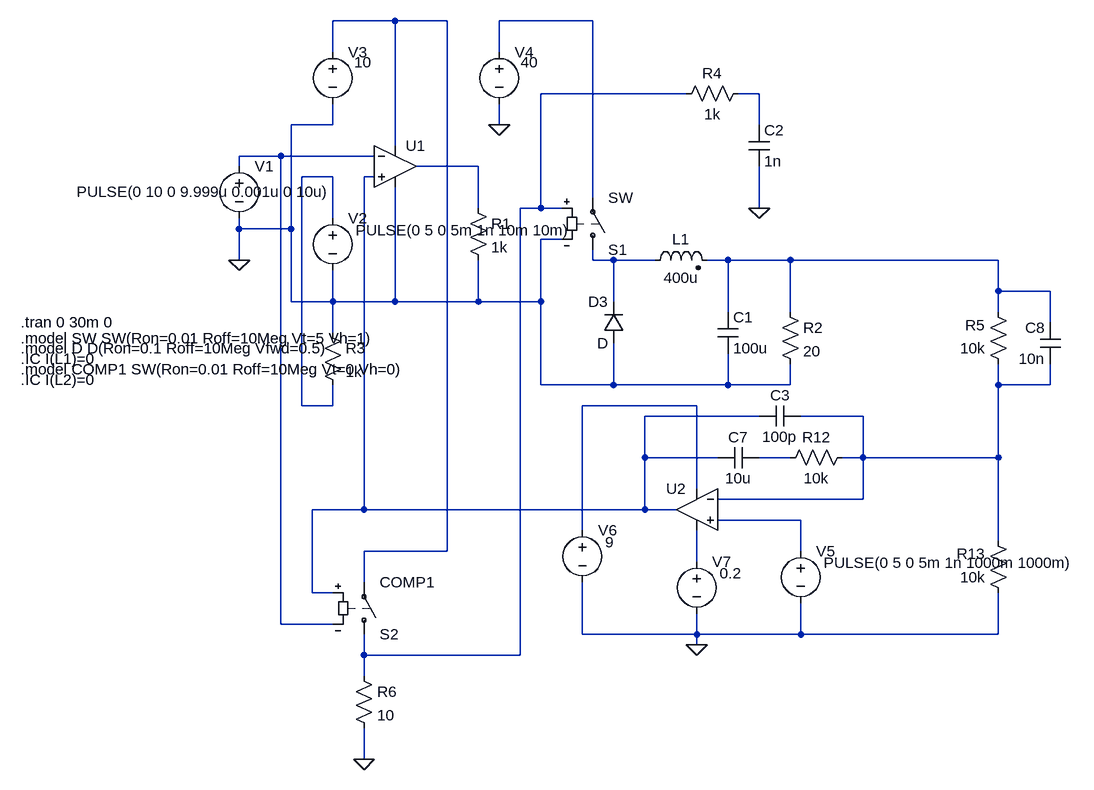
[diagram p0: schematic Variable_Buck.asc]
Variable_Buck.asc, the LTspice schematic file:
Version 4
SHEET 1 1636 2300
WIRE 368 -112 272 -112
WIRE 448 -112 368 -112
WIRE 672 -112 528 -112
WIRE 272 -64 272 -112
WIRE 528 -64 528 -112
WIRE 816 0 592 0
WIRE 928 0 896 0
WIRE 272 48 272 16
WIRE 272 48 208 48
WIRE 528 48 528 16
WIRE 928 48 928 0
WIRE 368 80 368 -112
WIRE 192 96 128 96
WIRE 336 96 192 96
WIRE 128 112 128 96
WIRE 496 112 400 112
WIRE 272 128 224 128
WIRE 336 128 320 128
WIRE 672 160 672 -112
WIRE 496 176 496 112
WIRE 592 176 592 0
WIRE 592 176 560 176
WIRE 624 176 592 176
WIRE 928 176 928 112
WIRE 272 192 272 128
WIRE 128 208 128 192
WIRE 208 208 208 48
WIRE 208 208 128 208
WIRE 624 224 592 224
WIRE 128 256 128 208
WIRE 672 256 672 240
WIRE 704 256 672 256
WIRE 768 256 704 256
WIRE 880 256 848 256
WIRE 976 256 880 256
WIRE 1296 256 976 256
WIRE 1296 304 1296 256
WIRE 1376 304 1296 304
WIRE 208 320 208 208
WIRE 272 320 272 272
WIRE 272 320 208 320
WIRE 368 320 368 144
WIRE 368 320 272 320
WIRE 496 320 496 256
WIRE 496 320 368 320
WIRE 592 320 592 224
WIRE 592 320 496 320
WIRE 704 320 704 256
WIRE 880 336 880 256
WIRE 976 336 976 256
WIRE 1296 336 1296 304
WIRE 1376 352 1376 304
WIRE 272 368 272 320
WIRE 592 448 592 320
WIRE 704 448 704 384
WIRE 704 448 592 448
WIRE 880 448 880 400
WIRE 880 448 704 448
WIRE 976 448 976 416
WIRE 976 448 880 448
WIRE 1296 448 1296 416
WIRE 1376 448 1376 416
WIRE 1376 448 1296 448
WIRE 224 480 224 128
WIRE 272 480 272 448
WIRE 272 480 224 480
WIRE 832 480 656 480
WIRE 928 496 752 496
WIRE 1088 496 992 496
WIRE 752 560 752 496
WIRE 864 560 752 560
WIRE 976 560 928 560
WIRE 1088 560 1088 496
WIRE 1088 560 1056 560
WIRE 1296 560 1296 448
WIRE 1296 560 1088 560
WIRE 832 608 832 480
WIRE 1088 624 1088 560
WIRE 1088 624 864 624
WIRE 320 640 320 128
WIRE 320 640 240 640
WIRE 752 640 752 560
WIRE 752 640 320 640
WIRE 800 640 752 640
WIRE 992 656 864 656
WIRE 656 672 656 480
WIRE 1296 688 1296 560
WIRE 448 704 448 -112
WIRE 448 704 320 704
WIRE 992 704 992 656
WIRE 832 720 832 672
WIRE 320 752 320 704
WIRE 240 768 240 640
WIRE 272 768 240 768
WIRE 192 816 192 96
WIRE 272 816 192 816
WIRE 656 832 656 752
WIRE 832 832 832 800
WIRE 832 832 656 832
WIRE 992 832 992 784
WIRE 992 832 832 832
WIRE 1296 832 1296 768
WIRE 1296 832 992 832
WIRE 832 848 832 832
WIRE 320 864 320 832
WIRE 560 864 560 176
WIRE 560 864 320 864
WIRE 320 896 320 864
WIRE 320 1024 320 976
FLAG 128 256 0
FLAG 528 48 0
FLAG 832 848 0
FLAG 928 176 0
FLAG 320 1024 0
SYMBOL voltage 128 96 R0
WINDOW 3 -250 55 Left 2
WINDOW 123 0 0 Left 0
WINDOW 39 0 0 Left 0
SYMATTR Value PULSE(0 10 0 9.999u 0.001u 0 10u)
SYMATTR InstName V1
SYMBOL OpAmps\\UniversalOpamp2 368 112 R0
SYMATTR InstName U1
SYMBOL voltage 272 176 R0
WINDOW 3 35 34 Left 2
WINDOW 123 0 0 Left 0
WINDOW 39 0 0 Left 0
SYMATTR Value PULSE(0 5 0 5m 1n 10m 10m)
SYMATTR InstName V2
SYMBOL voltage 272 -80 R0
WINDOW 3 33 32 Left 2
WINDOW 123 0 0 Left 0
WINDOW 39 0 0 Left 0
SYMATTR Value 10
SYMATTR InstName V3
SYMBOL res 480 160 R0
SYMATTR InstName R1
SYMATTR Value 1k
SYMBOL sw 672 256 M180
SYMATTR InstName S1
SYMBOL voltage 528 -80 R0
WINDOW 3 33 32 Left 2
WINDOW 123 0 0 Left 0
WINDOW 39 0 0 Left 0
SYMATTR Value 40
SYMATTR InstName V4
SYMBOL ind2 752 272 R270
WINDOW 0 32 56 VTop 2
WINDOW 3 4 56 VBottom 2
SYMATTR InstName L1
SYMATTR Value 400u
SYMBOL cap 864 336 R0
SYMATTR InstName C1
SYMATTR Value 100u
SYMATTR Value2 IC=0
SYMBOL res 960 320 R0
SYMATTR InstName R2
SYMATTR Value 20
SYMBOL OpAmps\\UniversalOpamp2 832 640 M0
SYMATTR InstName U2
SYMBOL res 256 352 R0
SYMATTR InstName R3
SYMATTR Value 1k
SYMBOL voltage 992 688 R0
WINDOW 3 35 34 Left 2
WINDOW 123 0 0 Left 0
WINDOW 39 0 0 Left 0
SYMATTR Value PULSE(0 5 0 5m 1n 1000m 1000m)
SYMATTR InstName V5
SYMBOL res 912 -16 R90
WINDOW 0 0 56 VBottom 2
WINDOW 3 32 56 VTop 2
SYMATTR InstName R4
SYMATTR Value 1k
SYMBOL cap 912 48 R0
SYMATTR InstName C2
SYMATTR Value 1n
SYMATTR Value2 IC=0
SYMBOL res 1312 432 R180
WINDOW 0 36 76 Left 2
WINDOW 3 36 40 Left 2
SYMATTR InstName R5
SYMATTR Value 10k
SYMBOL voltage 656 656 R0
WINDOW 3 35 34 Left 2
WINDOW 123 0 0 Left 0
WINDOW 39 0 0 Left 0
SYMATTR Value 9
SYMATTR InstName V6
SYMBOL voltage 832 704 R0
WINDOW 3 35 34 Left 2
WINDOW 123 0 0 Left 0
WINDOW 39 0 0 Left 0
SYMATTR Value 0.2
SYMATTR InstName V7
SYMBOL sw 320 848 M180
SYMATTR InstName S2
SYMATTR Value COMP1
SYMBOL res 304 880 R0
SYMATTR InstName R6
SYMATTR Value 10
SYMBOL cap 992 480 R90
WINDOW 0 0 32 VBottom 2
WINDOW 3 32 32 VTop 2
SYMATTR InstName C3
SYMATTR Value 100p
SYMATTR Value2 IC=0
SYMBOL res 960 576 R270
WINDOW 0 32 56 VTop 2
WINDOW 3 0 56 VBottom 2
SYMATTR InstName R12
SYMATTR Value 10k
SYMBOL cap 928 544 R90
WINDOW 0 0 32 VBottom 2
WINDOW 3 32 32 VTop 2
SYMATTR InstName C7
SYMATTR Value 10u
SYMATTR Value2 IC=0
SYMBOL cap 1392 416 R180
WINDOW 0 24 56 Left 2
WINDOW 3 24 8 Left 2
SYMATTR InstName C8
SYMATTR Value 10n
SYMATTR Value2 IC=0
SYMBOL diode 720 384 R180
WINDOW 0 24 64 Left 2
WINDOW 3 24 0 Left 2
SYMATTR InstName D3
SYMBOL res 1312 784 R180
WINDOW 0 36 76 Left 2
WINDOW 3 36 40 Left 2
SYMATTR InstName R13
SYMATTR Value 10k
TEXT -208 352 Left 2 !.tran 0 30m 0
TEXT -208 376 Left 2 !.model SW SW(Ron=0.01 Roff=10Meg Vt=5 Vh=1)
TEXT -208 392 Left 2 !.model D D(Ron=0.1 Roff=10Meg Vfwd=0.5)
TEXT -208 408 Left 2 !.IC I(L1)=0
TEXT -208 424 Left 2 !.model COMP1 SW(Ron=0.01 Roff=10Meg Vt=0 Vh=0)
TEXT -208 440 Left 2 !.IC I(L2)=0

The netlist it stands for:
* Variable_Buck.asc
V1 N005 0 PULSE(0 10 0 9.999u 0.001u 0 10u)
XU1 N008 N005 N001 0 N006 level.2 Avol=1Meg GBW=10Meg Slew=10Meg ilimit=25m rail=0 Vos=0 phimargin=45 en=0 enk=0 in=0 ink=0 Rin=500Meg  ; pins IN+ IN- V+ V- OUT
V2 N007 0 PULSE(0 5 0 5m 1n 10m 10m)
V3 N001 0 10
R1 N006 0 1k
S1 N009 N002 N003 0 SW
V4 N002 0 40
L1 N009 N010 400u
C1 N010 0 100u IC=0
R2 N010 0 20
XU2 N014 N011 N012 N015 N008 level.2 Avol=1Meg GBW=10Meg Slew=10Meg ilimit=25m rail=0 Vos=0 phimargin=45 en=0 enk=0 in=0 ink=0 Rin=500Meg  ; pins IN+ IN- V+ V- OUT
R3 0 N007 1k
V5 N014 0 PULSE(0 5 0 5m 1n 1000m 1000m)
R4 N004 N003 1k
C2 N004 0 1n IC=0
R5 N011 N010 10k
V6 N012 0 9
V7 N015 0 0.2
S2 N003 N001 N008 N005 COMP1
R6 N003 0 10
C3 N011 N008 100p IC=0
R12 N013 N011 10k
C7 N013 N008 10u IC=0
C8 N011 N010 10n IC=0
D3 0 N009 D
R13 0 N011 10k
.model D D
.lib standard.dio
.tran 0 30m 0
.model SW SW(Ron=0.01 Roff=10Meg Vt=5 Vh=1)
.model D D(Ron=0.1 Roff=10Meg Vfwd=0.5)
.IC I(L1)=0
.model COMP1 SW(Ron=0.01 Roff=10Meg Vt=0 Vh=0)
.IC I(L2)=0
.lib UniversalOpamps2.sub
.backanno
.end